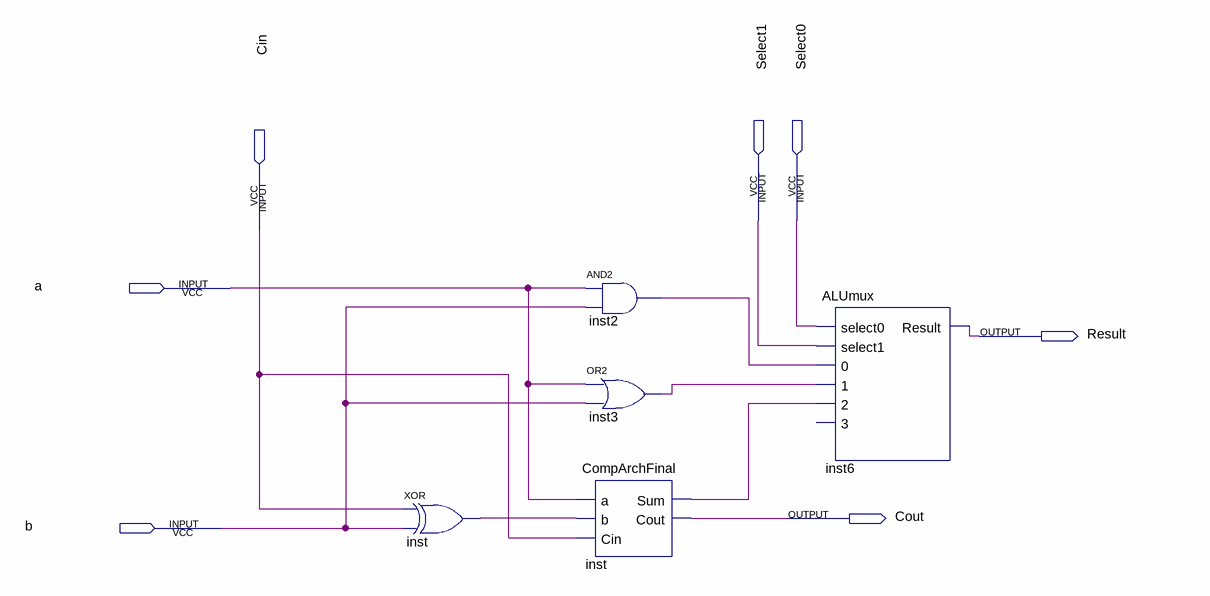
[diagram p0: schematic sheet]
// Quartus schematic ALU.bdf as structural Verilog: 5 symbols, 7 pins
module ALU (
  input  Select1,
  input  Select0,
  input  Cin,
  input  a,
  input  b,
  output Result,
  output Cout
);

  wire inst2_out, inst3_out, inst_out, inst_sum;

  xor inst (inst_out, Cin, b);
  and inst2 (inst2_out, a, b);
  or inst3 (inst3_out, a, b);
  CompArchFinal inst_dup2 (.a(a), .b(inst_out), .Cin(Cin), .Sum(inst_sum), .Cout(Cout));
  ALUmux inst6 (
    .select0(Select0), .select1(Select1), .\0 (inst2_out), .\1 (inst3_out), .\2 (inst_sum), .Result(Result));  // open: 3
endmodule
